# Altium schematic sheet 60V_Detector.SchDoc
size A4; SheetNumber: 2; SheetTotal: 4
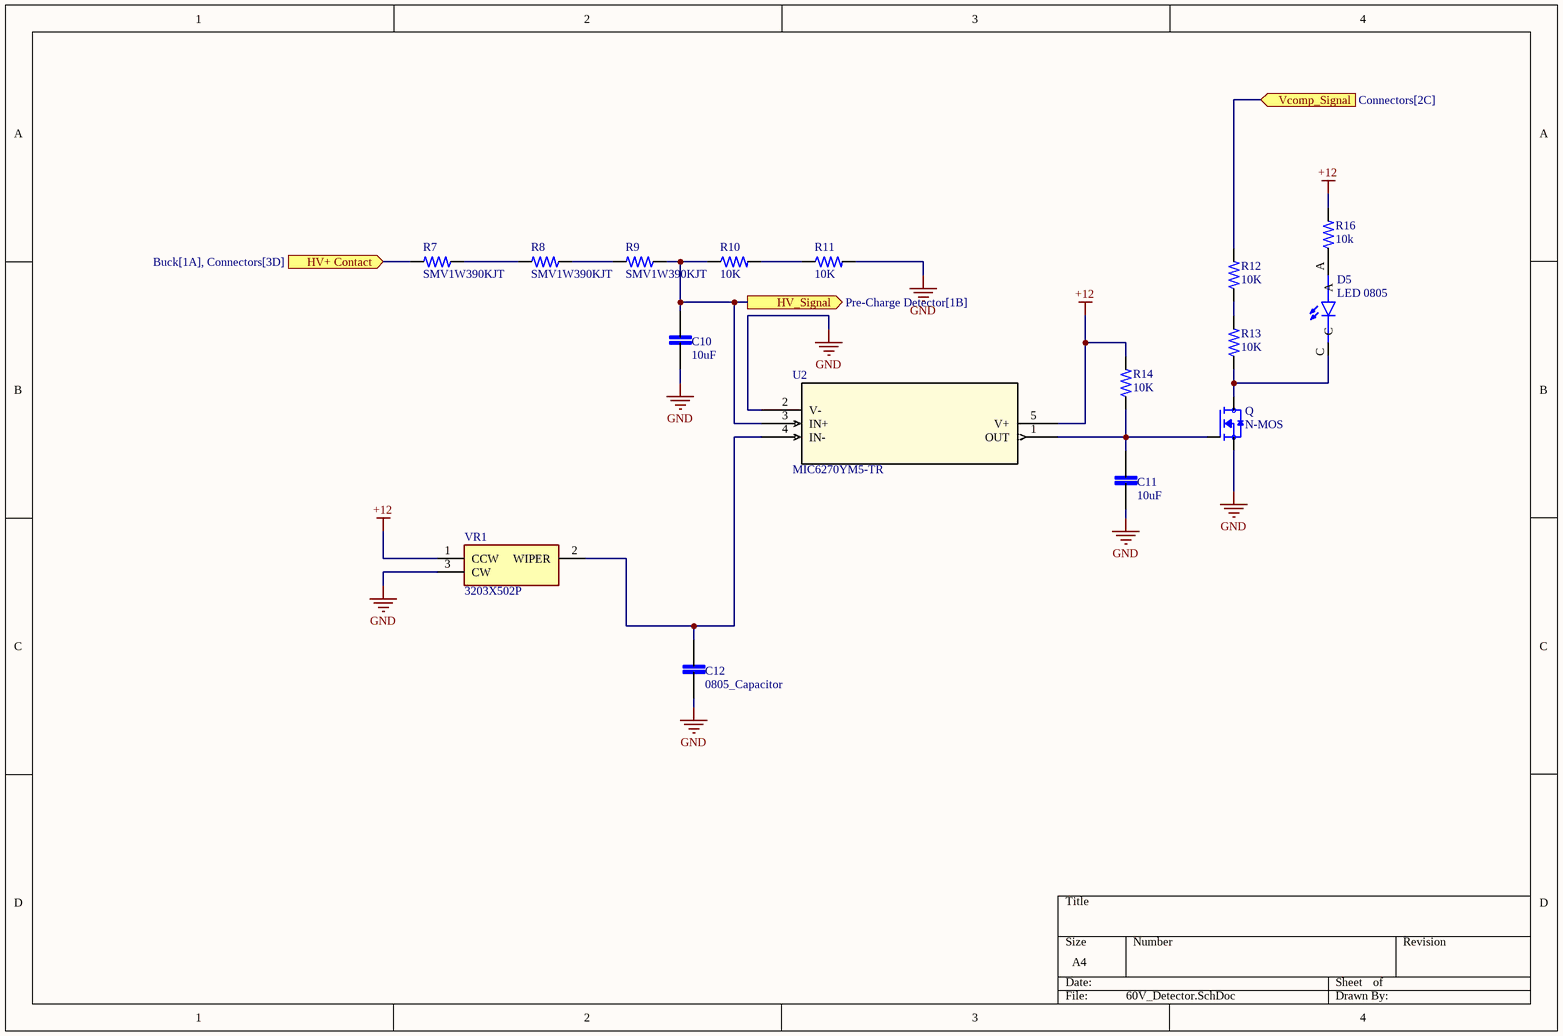
[diagram p0: 60V_Detector.SchDoc]

## Parts
C10  10uF  [0805]
C11  10uF  [0805]
C12  0805_Capacitor  [0805]
D5  LED 0805  [LED 0805]
Q  N-MOS  [AO3402]
R7  SMV1W390KJT  [SMV1W390KJT]
R8  SMV1W390KJT  [SMV1W390KJT]
R9  SMV1W390KJT  [SMV1W390KJT]
R10  10K  [0805]
R11  10K  [0805]
R12  10K  [0805]
R13  10K  [0805]
R14  10K  [0805]
R16  10k  [0805]
U2  MIC6270YM5-TR  [MIC6270]
VR1  3203X502P  [3203X502P]

## Ports
HV+ Contact (in, see Buck[1A], Connectors[3D]), HV_Signal (out, see Pre-Charge Detector[1B]), Vcomp_Signal (in, see Connectors[2C])

## Nets
+12: R14.2 R16.2 U2.5(V+) VR1.1(CCW)
GND: C10.1 C11.1 C12.1 Q.2(S) R11.2 U2.2(V-) VR1.3(CW)
HV+ Contact: R7.2 ; port HV+ Contact
HV_Signal: C10.2 R9.1 R10.1 U2.3(IN+) ; port HV_Signal
Vcomp_Signal: R12.2 ; port Vcomp_Signal
NetC11_2: C11.2 Q.1(G) R14.1 U2.1(OUT)
NetC12_2: C12.2 U2.4(IN-) VR1.2(WIPER)
NetD5_A: D5.A R16.1
NetD5_C: D5.C Q.3(D) R13.1
NetR7_1: R7.1 R8.2
NetR8_1: R8.1 R9.2
NetR10_2: R10.2 R11.1
NetR12_1: R12.1 R13.2

## Library data of the parts
C10-C12 = 0805_Capacitor: MP: LD051A121KAB2A; MF: AVX; SnapEDA_Link: https://www.snapeda.com/parts/LD051A121KAB2A/AVX/view-part/?ref=snap; Package: 0805 AVX; Check_prices: https://www.snapeda.com/parts/LD051A121KAB2A/AVX/view-part/?ref=eda; Purchase-URL: https://pricing.snapeda.com/search/part/LD051A121KAB2A/?ref=eda; Price: None; Value: *; Availability: In Stock
D5 = LED 0805: LED Uni-Color Green 4-Pin Chip 0805 T/R; MP: 597-3305-607F; Availability: Unavailable; Value: *; Price: None; Package: None
Q = N-MOS: D-PAK; MF: Alpha &; Digi-Key_Purchase_URL: https://www.digikey.ca/product-detail/en/alpha-omega-semiconductor-inc/AO3402/785-1002-1-ND/1855944?utm_source=snapeda&utm_medium=aggregator&utm_campaign=symbol; Value: *; MP: AO3402; Package: SOT-23 Alpha &amp; Omega Semiconductor; SnapEDA_Link: https://www.snapeda.com/parts/AO3402/Alpha%20&%20Omega%20Semiconductor%20Inc./view-part/564857/?ref=snap; Digi-Key_Part_Number: 785-1002-1-ND
R7-R9 = SMV1W390KJT: Power_Rating: .25 W; MP: 2-2176053-0; Tolerance: 1%; Resistance: .33; MF: TE Connectivity; Price: None; Availability: In Stock; EU_RoHS_Compliance: Compliant with Exemptions; Package: 0805; Value: *; SnapEDA_Link: https://www.snapeda.com/parts/2-2176053-0/TE+Connectivity/view-part/?ref=snap; Check_prices: https://www.snapeda.com/parts/2-2176053-0/TE+Connectivity/view-part/?ref=eda
R10-R14 R16 = 0805_Resistor: Power_Rating: .25 W; MP: 2-2176053-0; Tolerance: 1%; Resistance: .33; MF: TE Connectivity; Price: None; Availability: In Stock; EU_RoHS_Compliance: Compliant with Exemptions; Package: 0805; Value: *; SnapEDA_Link: https://www.snapeda.com/parts/2-2176053-0/TE+Connectivity/view-part/?ref=snap; Check_prices: https://www.snapeda.com/parts/2-2176053-0/TE+Connectivity/view-part/?ref=eda
U2 = MIC6270YM5-TR: No Description Available; Mfr_Name: Microchip; Copyright: Copyright (C) 2024 Ultra Librarian. All rights reserved.; Manufacturer_Part_Number: MIC6270YM5-TR; RefDes: RefDes; Type: DEV
VR1 = 3203X502P: Variable Resistor; Manufacturer_Name: TE Connectivity; Datasheet Link: https://www.te.com/commerce/DocumentDelivery/DDEController?Action=showdoc&DocId=Customer+Drawing%7F1623916%7FBA1%7Fpdf%7FEnglish%7FENG_CD_1623916_BA1.pdf%7F1-1623916-0; Height: 2.1mm; Manufacturer_Part_Number: 3203X502P; Mouser Part Number: 279-3203X502P; Mouser Price/Stock: https://www.mouser.co.uk/ProductDetail/TE-Connectivity-Holsworthy/3203X502P?qs=GP7tGcbp1QQJNQgoJp42%2Fg%3D%3D; Arrow Part Number: 3203X502P; Arrow Price/Stock: https://www.arrow.com/en/products/3203x502p/te-connectivity?region=nac